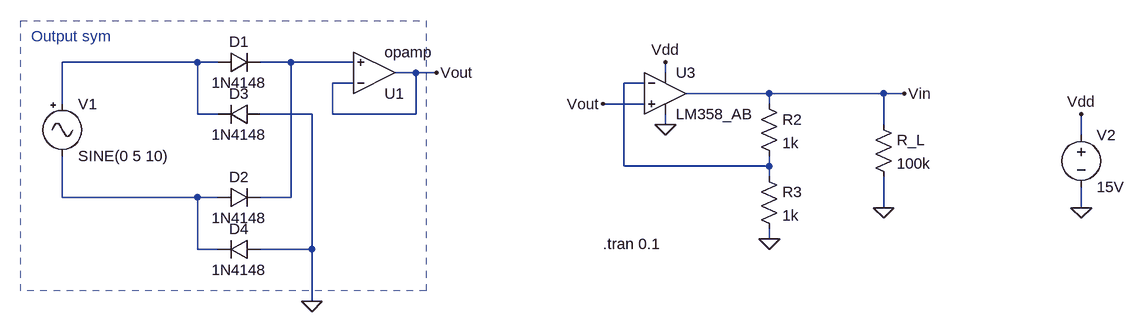
[diagram p0: schematic valves.asc]
valves.asc, the LTspice schematic file:
Version 4
SHEET 1 1048 680
WIRE -384 64 -592 64
WIRE -352 64 -384 64
WIRE -240 64 -288 64
WIRE -144 64 -240 64
WIRE -48 80 -80 80
WIRE -16 80 -48 80
WIRE 336 80 336 64
WIRE -144 96 -176 96
WIRE 304 96 272 96
WIRE 496 112 368 112
WIRE 672 112 496 112
WIRE 704 112 672 112
WIRE -592 128 -592 64
WIRE 304 128 240 128
WIRE 496 128 496 112
WIRE -384 144 -384 64
WIRE -352 144 -384 144
WIRE -208 144 -288 144
WIRE -176 144 -176 96
WIRE -48 144 -48 80
WIRE -48 144 -176 144
WIRE 336 160 336 144
WIRE 672 160 672 112
WIRE 976 176 976 144
WIRE 272 224 272 96
WIRE 496 224 496 208
WIRE 496 224 272 224
WIRE 496 240 496 224
WIRE -592 272 -592 208
WIRE -384 272 -592 272
WIRE -352 272 -384 272
WIRE -240 272 -240 64
WIRE -240 272 -288 272
WIRE 672 288 672 240
WIRE 976 288 976 256
WIRE 496 336 496 320
WIRE -384 352 -384 272
WIRE -352 352 -384 352
WIRE -208 352 -208 144
WIRE -208 352 -288 352
WIRE -208 432 -208 352
FLAG -208 432 0
FLAG -16 80 Vout
FLAG 976 288 0
FLAG 976 144 Vdd
FLAG 336 160 0
FLAG 336 64 Vdd
FLAG 672 288 0
FLAG 240 128 Vout
FLAG 496 336 0
FLAG 704 112 Vin
SYMBOL res 656 144 R0
SYMATTR InstName R_L
SYMATTR Value 100k
SYMBOL Misc\\signal -592 112 R0
WINDOW 123 0 0 Left 0
WINDOW 39 0 0 Left 0
SYMATTR InstName V1
SYMATTR Value SINE(0 5 10)
SYMBOL diode -352 80 R270
WINDOW 0 32 32 VTop 2
WINDOW 3 0 32 VBottom 2
SYMATTR InstName D1
SYMATTR Value 1N4148
SYMBOL voltage 976 160 R0
SYMATTR InstName V2
SYMATTR Value 15V
SYMBOL res 480 112 R0
SYMATTR InstName R2
SYMATTR Value 1k
SYMBOL res 480 224 R0
SYMATTR InstName R3
SYMATTR Value 1k
SYMBOL diode -352 288 R270
WINDOW 0 32 32 VTop 2
WINDOW 3 0 32 VBottom 2
SYMATTR InstName D2
SYMATTR Value 1N4148
SYMBOL diode -288 160 M270
WINDOW 0 32 32 VTop 2
WINDOW 3 0 32 VBottom 2
SYMATTR InstName D3
SYMATTR Value 1N4148
SYMBOL diode -288 368 M270
WINDOW 0 32 32 VTop 2
WINDOW 3 0 32 VBottom 2
SYMATTR InstName D4
SYMATTR Value 1N4148
SYMBOL opamp -112 144 M180
SYMATTR InstName U1
SYMBOL ZZZ\\OpAmp\\LM358_AB 336 48 R0
SYMATTR InstName U3
TEXT 240 344 Left 2 !.tran 0.1
TEXT -640 24 Left 2 ;Output sym
RECTANGLE Normal -32 416 -656 0 2

The netlist it stands for:
* valves.asc
R_L Vin 0 100k
V1 N001 N004 SINE(0 5 10)
D1 N001 N002 1N4148
V2 Vdd 0 15V
R2 Vin N003 1k
R3 N003 0 1k
D2 N004 N002 1N4148
D3 0 N001 1N4148
D4 0 N004 1N4148
XU1 Vout N002 Vout opamp Aol=100K GBW=10Meg  ; pins invin noninvin out
* U3: LM358_AB (symbol ZZZ\OpAmp\LM358_AB not available, pins judged from their places): In+=Vout In-=N003 V+=Vdd V-=0 OUT=Vin
.model D D
.lib standard.dio
.tran 0.1
* Output sym
.backanno
.end